# EAGLE schematic apple_all_pd1 (EAGLE 9.6.1)
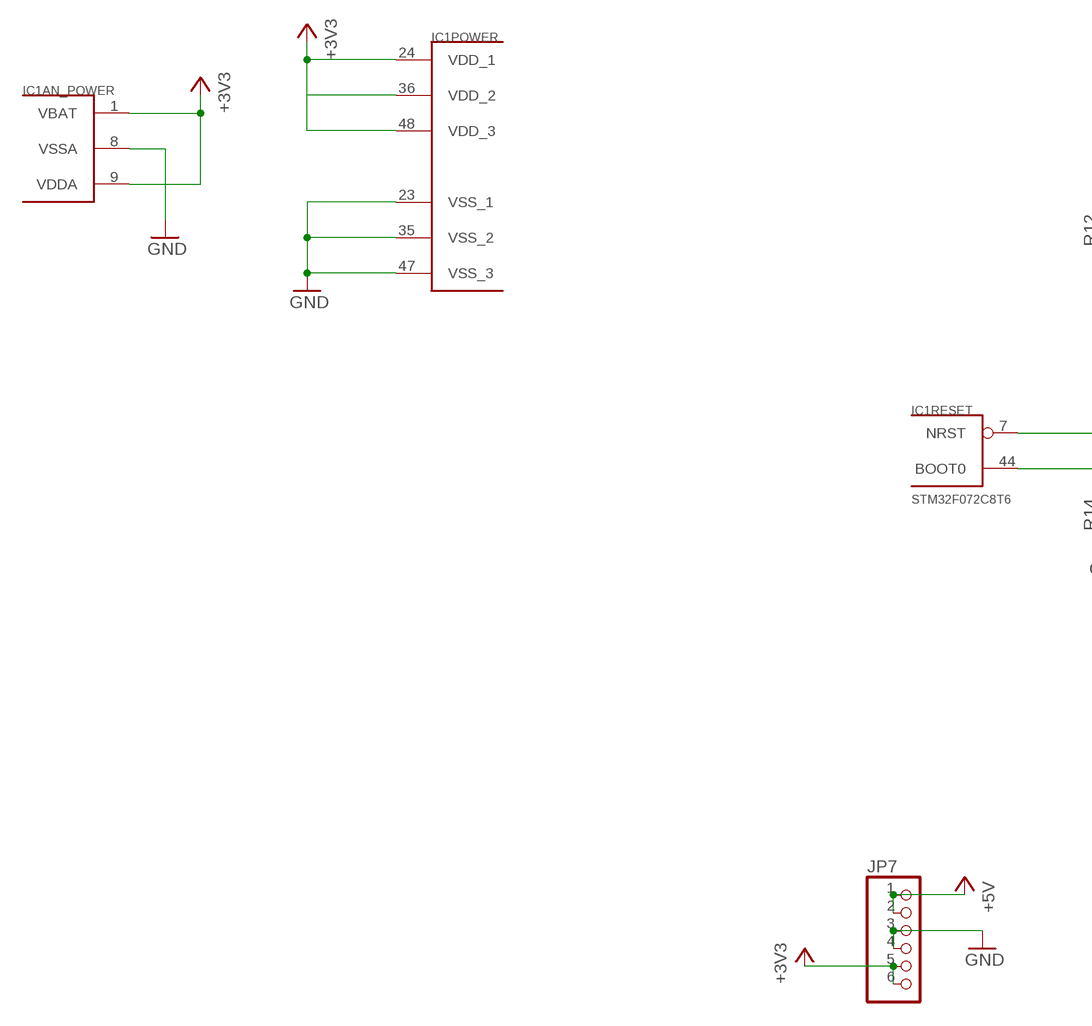
[diagram p0: schematic, sheet 1, part 1 of 2]
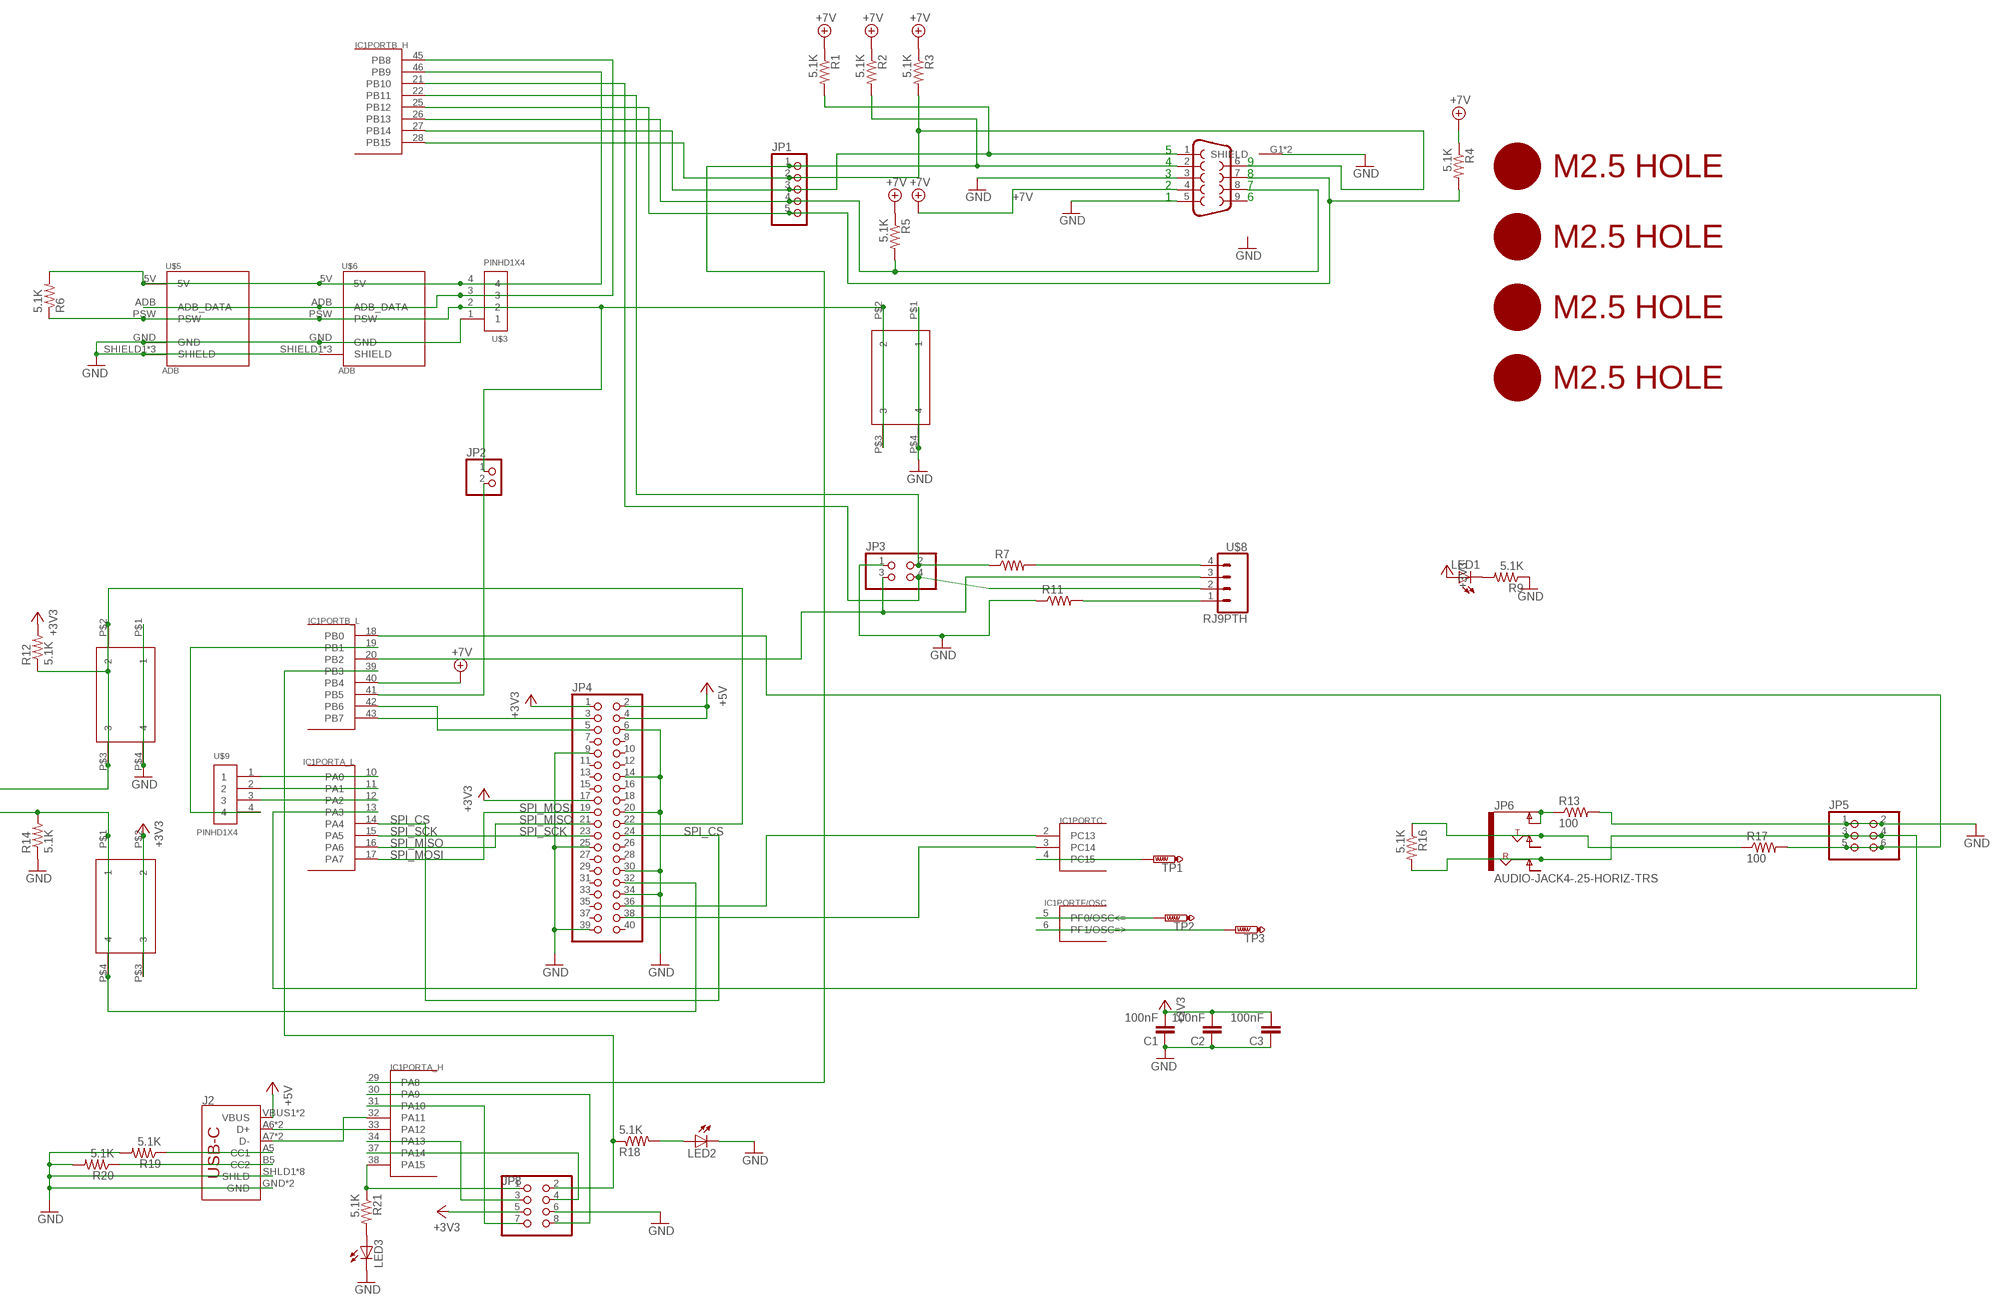
[diagram p1: schematic, sheet 1, part 2 of 2]

## Parts
C1  100nF  CAP0805  [0805@1]
C2  100nF  CAP0805  [0805@1]
C3  100nF  CAP0805  [0805@1]
IC1  STM32F072C8T6  [TQFP48]
J1  DB9FEMALE  [DB9]
J2  USB_C16PIN  [USB-C-16P]
JP1  PINHD-1X5  [1X05]
JP2  PINHD-1X2  [1X02]
JP3  PINHD-2X2  [2X02]
JP4  PINHD-2X20-BIG  [2X20-BIG]
JP5  PINHD-2X3  [2X03]
JP6  AUDIO-JACK4-.25-HORIZ-TRS  [AUDIO-JACK-.25-INCH-HORIZ-PTH]
JP7  PINHD-1X6CB  [1X06-CLEANBIG]
JP8  PINHD-2X4  [2X04]
LED1  LEDCHIP-LED0805  [CHIP-LED0805]
LED2  LEDCHIP-LED0805  [CHIP-LED0805]
LED3  LEDCHIP-LED0805  [CHIP-LED0805]
R1  5.1K  RESISTOR0805-RES  [0805]
R2  5.1K  RESISTOR0805-RES  [0805]
R3  5.1K  RESISTOR0805-RES  [0805]
R4  5.1K  RESISTOR0805-RES  [0805]
R5  5.1K  RESISTOR0805-RES  [0805]
R6  5.1K  RESISTOR0805-RES  [0805]
R7  100  RESISTOR0805-RES  [0805]
R9  5.1K  RESISTOR0805-RES  [0805]
R11  100  RESISTOR0805-RES  [0805]
R12  5.1K  RESISTOR0805-RES  [0805]
R13  100  RESISTOR0805-RES  [0805]
R14  5.1K  RESISTOR0805-RES  [0805]
R16  5.1K  RESISTOR0805-RES  [0805]
R17  100  RESISTOR0805-RES  [0805]
R18  5.1K  RESISTOR0805-RES  [0805]
R19  5.1K  RESISTOR0805-RES  [0805]
R20  5.1K  RESISTOR0805-RES  [0805]
R21  5.1K  RESISTOR0805-RES  [0805]
SW1  324_SW  [342_SWICH_FOOT]
SW2  324_SW  [342_SWICH_FOOT]
SW3  324_SW  [342_SWICH_FOOT]
TP1  PTR1TP14R  [TP14R]
TP2  PTR1TP14R  [TP14R]
TP3  PTR1TP14R  [TP14R]
U$1  M2.5HOLE  [M2.5HOLE]
U$2  M2.5HOLE  [M2.5HOLE]
U$3  PINHD1X4  [1X04-CLEANBIG]
U$4  M2.5HOLE  [M2.5HOLE]
U$5  ADB  [DIN4]
U$6  ADB  [DIN4]
U$7  M2.5HOLE  [M2.5HOLE]
U$8  RJ9PTH  [RJ9]
U$9  PINHD1X4  [1X04-CLEANBIG]

## Nets
+3V3: C1.2 C2.2 C3.2 IC1.1(AN_POWER:VBAT) IC1.9(AN_POWER:VDDA) IC1.24(POWER:VDD_1) IC1.36(POWER:VDD_2) IC1.48(POWER:VDD_3) JP4.1 JP4.17 JP7.5 JP7.6 JP8.5 LED1.A R12.2 SW3.P$2 SW3.P$3
+5V: J2.VBUS1(VBUS) J2.VBUS2(VBUS) JP4.2 JP4.4 JP7.1 JP7.2
+7V: IC1.40(PORTB_L:PB4) J1.4 R1.1 R2.1 R3.1 R4.1 R5.1
GND: C1.1 C2.1 C3.1 IC1.8(AN_POWER:VSSA) IC1.23(POWER:VSS_1) IC1.35(POWER:VSS_2) IC1.47(POWER:VSS_3) J1.3 J1.5 J1.G1(SHIELD) J1.G2(SHIELD) J2.GND J2.GND2(GND) J2.SHLD1(SHLD) J2.SHLD2(SHLD) J2.SHLD3(SHLD) J2.SHLD4(SHLD) J2.SHLD5(SHLD) J2.SHLD6(SHLD) J2.SHLD7(SHLD) J2.SHLD8(SHLD) JP3.1 JP4.6 JP4.9 JP4.14 JP4.20 JP4.25 JP4.30 JP4.34 JP4.39 JP5.1 JP5.2 JP7.3 JP7.4 JP8.6 LED2.C LED3.C R9.1 R11.1 R13.2 R14.1 R19.2 R20.2 SW1.P$1 SW1.P$4 SW2.P$1 SW2.P$4 U$3.1 U$5.GND U$5.SHIELD1(SHIELD) U$5.SHIELD2(SHIELD) U$5.SHIELD3(SHIELD) U$6.GND U$6.SHIELD1(SHIELD) U$6.SHIELD2(SHIELD) U$6.SHIELD3(SHIELD)
N$1: J2.A5(CC1) R19.1
N$2: LED2.A R18.2
N$3: IC1.46(PORTB_H:PB9) R6.2 U$3.4 U$5.5V U$6.5V
N$4: IC1.26(PORTB_H:PB13) J1.8 JP1.4 R5.2
N$5: R7.2 U$8.4
N$6: IC1.39(PORTB_L:PB3) JP8.2 R18.1
N$7: J2.B5(CC2) R20.1
N$8: IC1.33(PORTA_H:PA12) J2.A6(D+) J2.B6(D+)
N$9: IC1.32(PORTA_H:PA11) J2.A7(D-) J2.B7(D-)
N$10: IC1.41(PORTB_L:PB5) JP2.2
N$11: IC1.19(PORTB_L:PB1) U$9.4
N$12: IC1.31(PORTA_H:PA10) JP8.7
N$13: IC1.7(RESET:NRST) JP4.22 R12.1 SW2.P$2 SW2.P$3
N$14: IC1.30(PORTA_H:PA9) JP8.8
N$15: IC1.34(PORTA_H:PA13) JP8.3
N$16: IC1.37(PORTA_H:PA14) JP8.4
N$17: IC1.22(PORTB_H:PB11) JP3.2 R7.1
N$18: IC1.44(RESET:BOOT0) JP4.32 R14.2 SW3.P$1 SW3.P$4
N$19: IC1.21(PORTB_H:PB10) JP3.4 U$8.2
N$20: IC1.4(PORTC:PC15) TP1.TP
N$21: R11.2 U$8.1
N$22: IC1.42(PORTB_L:PB6) JP4.5
N$23: IC1.43(PORTB_L:PB7) JP4.3
N$24: JP6.SLEEVE(EARTH) JP6.SLEEVE-NORM(EARTH-NORM) R13.1
N$25: IC1.20(PORTB_L:PB2) JP3.3 U$8.3
N$26: IC1.27(PORTB_H:PB14) J1.1 JP1.3 R1.2
N$27: IC1.38(PORTA_H:PA15) JP8.1 R21.1
N$28: LED3.A R21.2
N$29: LED1.C R9.2
N$30: IC1.13(PORTA_L:PA3) JP5.3 JP5.4 JP6.RING R16.2
N$31: IC1.18(PORTB_L:PB0) JP5.5 JP5.6 R17.2
N$32: JP6.TIP R16.1 R17.1
N$33: IC1.3(PORTC:PC14) JP4.38
N$34: IC1.28(PORTB_H:PB15) J1.6 JP1.2 R3.2
N$35: IC1.25(PORTB_H:PB12) J1.7 JP1.5 R4.2
N$36: IC1.29(PORTA_H:PA8) J1.2 JP1.1 R2.2
N$37: IC1.2(PORTC:PC13) JP4.36
N$38: IC1.10(PORTA_L:PA0) U$9.1
N$39: IC1.11(PORTA_L:PA1) U$9.2
N$40: IC1.12(PORTA_L:PA2) U$9.3
N$41: IC1.5(PORTF/OSC:PF0/OSC<=) TP2.TP
N$42: IC1.6(PORTF/OSC:PF1/OSC=>) TP3.TP
N$43: IC1.45(PORTB_H:PB8) U$3.3 U$5.ADB(ADB_DATA) U$6.ADB(ADB_DATA)
N$46: JP2.1 R6.1 SW1.P$2 SW1.P$3 U$3.2 U$5.PSW U$6.PSW
SPI_CS: IC1.14(PORTA_L:PA4) JP4.24
SPI_MISO: IC1.16(PORTA_L:PA6) JP4.21
SPI_MOSI: IC1.17(PORTA_L:PA7) JP4.19
SPI_SCK: IC1.15(PORTA_L:PA5) JP4.23
Unconnected: J1.9 JP4.7 JP4.8 JP4.10 JP4.11 JP4.12 JP4.13 JP4.15 JP4.16 JP4.18 JP4.26 JP4.27 JP4.28 JP4.29 JP4.31 JP4.33 JP4.35 JP4.37 JP4.40 JP6.RING-NORM JP6.TIP-NORM

## Notes on the sheet
- 5
- 4 | 9
- 3 | 8
- 2 | 7
- 1 | 6

## Library data of the parts
C1-C3 = clock:CAP: Capacitor Standard 0603 ceramic capacitor, and 0.1" leaded capacitor.
IC1 = clock:STM32F072C8T6: ST STM32F072 48pin LQFP
J1 = SparkFun-Connectors:DB9: DB9 Connector Standard DB9 (D-Sub 9) serial connector. Can be used for CAN bus as well as RS485 and RS232. Footprint production proven. Here is the female version connector we sell at SparkFun: 9 Pin Female Serial Connector - PCB Mount <https://www.sparkfun.com/products/429> (PRT-00429) This connector has been used on the following SparkFun products: SparkFun RS232 Shifter - SMD <https://www.sparkfun.com/products/449> (PRT-00449) SparkFun RS232 Shifter SMD (No DB9) <https://www.sparkfun.com/products/8780> (PRT-08780); PROD_ID: CONN-08194
J2 = SparkFun-Connectors:USB_C: USB Type C 16Pin Connector Super Speed pins not available on the 16-pin purely SMD connector so this part is best for USB 2.0 implementations. D1 and D2 are tied together enabling D+/- no matter which way the cable is plugged into the connector. The two channel configuration pins (CC1/2) are exposed. These are normally connected to ground via 5.1k resistors but can be reconfigured for high current/high power applications.; PROD_ID: CONN-14122
JP1 = pinhead:PINHD-1X5: PIN HEADER
JP2 = pinhead:PINHD-1X2: PIN HEADER
JP3 = pinhead:PINHD-2X2: PIN HEADER
JP4 = adafruit_changed:PINHD-2X20: PIN HEADER
JP5 = pinhead:PINHD-2X3: PIN HEADER
JP6 = SparkFun-Connectors:AUDIO-JACK4-.25-HORIZ-TRS: 1/4" TRS jack, horizontal Production SKU: COM-11144 Footprint unproven - datasheet and part seem to be slightly different; PROD_ID: COM-11144
JP7 = adafruit:PINHD-1X6: PIN HEADER
JP8 = pinhead:PINHD-2X4: PIN HEADER
LED1-LED3 = adafruit:LED: LED OSRAM: - CHIPLED LG R971, LG N971, LY N971, LG Q971, LY Q971, LO R971, LY R971 LH N974, LH R974 LS Q976, LO Q976, LY Q976 LO Q996 - Hyper CHIPLED LW Q18S LB Q993, LB Q99A, LB R99A - SideLED LS A670, LO A670, LY A670, LG A670, LP A670 LB A673, LV A673, LT A673, LW A673 LH A674 LY A675 LS A676, LA A676, LO A676, LY A676, LW A676 LS A679, LY A679, LG A679 - Hyper Micro SIDELED® LS Y876, LA Y876, LO Y876, LY Y876 LT Y87S - SmartLED LW L88C, LW L88S LB L89C, LB L89S, LG L890 LS L89K, LO L89K, LY L89K LS L896, LA L896, LO L896, LY L896 - TOPLED LS T670, LO T670, LY T670, LG T670, LP T670 LSG T670, LSP T670, LSY T670, LOP T670, LYG T670 LG T671, LOG T671, LSG T671 LB T673, LV T673, LT T673, LW T673 LH T674 LS T676, LA T676, LO T676, LY T676, LB T676, LH T676, LSB T676, LW T676 LB T67C, LV T67C, LT T67C, LS T67K, LO T67K, LY T67K, LW E67C LS E67B, LA E67B, LO E67B, LY E67B, LB E67C, LV E67C, LT E67C LW T67C LS T679, LY T679, LG T679 LS T770, LO T770, LY T770, LG T770, LP T770 LB T773, LV T773, LT T773, LW T773 LH T774 LS E675, LA E675, LY E675, LS T675 LS T776, LA T776, LO T776, LY T776, LB T776 LHGB T686 LT T68C, LB T68C - Hyper Mini TOPLED® LB M676 - Mini TOPLED Santana® LG M470 LS M47K, LO M47K, LY M47K Source: http://www.osram.convergy.de/
R1-R7 R9 R11-R14 R16-R21 = SparkFun-Passives:RESISTOR: Resistor Basic schematic elements and footprints for 0603, 1206, and PTH resistors.
SW1-SW3 = 3pos_slide_switch_centered:324_SW
TP1-TP3 = testpad:PTR1: TEST PIN
U$1 U$2 U$4 U$7 = f1c100s:M2.5HOLE
U$3 U$9 = adafruit_changed:PINHD1X4
U$5 U$6 = adb:ADB
U$8 = SparkFun-Retired:RJ9: This is a 4-pin connector commonly found on phone handsets. Great for simple TX/RX/PWR/GND connections. Sometime referred to as RJ9 or 4P4C. SparkFun does not currently use this on any active designs, and the connector alone has been retired. However, for more info visit here: https://www.sparkfun.com/products/retired/8694

## Net classes
1 power: width 0.178 mm